# Altium schematic sheet TIDA-010954-Top.SchDoc
size 431 x 279 mm; Date: Not shown in title block; ApprovedBy: Not shown in title block; CheckedBy: Not shown in title block; Author: Not shown in title block; CompanyName: Not shown in title block; Engineer: Not shown in title block; Organization: Not shown in title block; Address1: Not shown in title block; Address2: Not shown in title block; Address3: Not shown in title block; Address4: Not shown in title block; DocumentNumber: 2; Revision: Use project parameter SCH_Rev; SheetNumber: 1; SheetTotal: 9; PageSetup: Record=PageOptions|CenterHorizontal=True|CenterVertical=True|PrintScale=1.00|XCorrection=1.00|YCorrection=1.00|PrintKind=0|BorderSize=5000000|LeftOffset=0|BottomOffset=0|Orientation=2|PaperLength=1000|PaperWidth=1000|Scale=100|PaperSource=15|PrintQuality=600|MediaType=1|DitherType=10|PaperKind=Letter|PrintScaleMode=1; CurrentTime: Not shown in title block; CurrentDate: Not shown in title block; Time: Not shown in title block; DocumentFullPathAndName: Not shown in title block; DocumentName: Not shown in title block; ModifiedDate: 1/25/2022; ImagePath: Not shown in title block
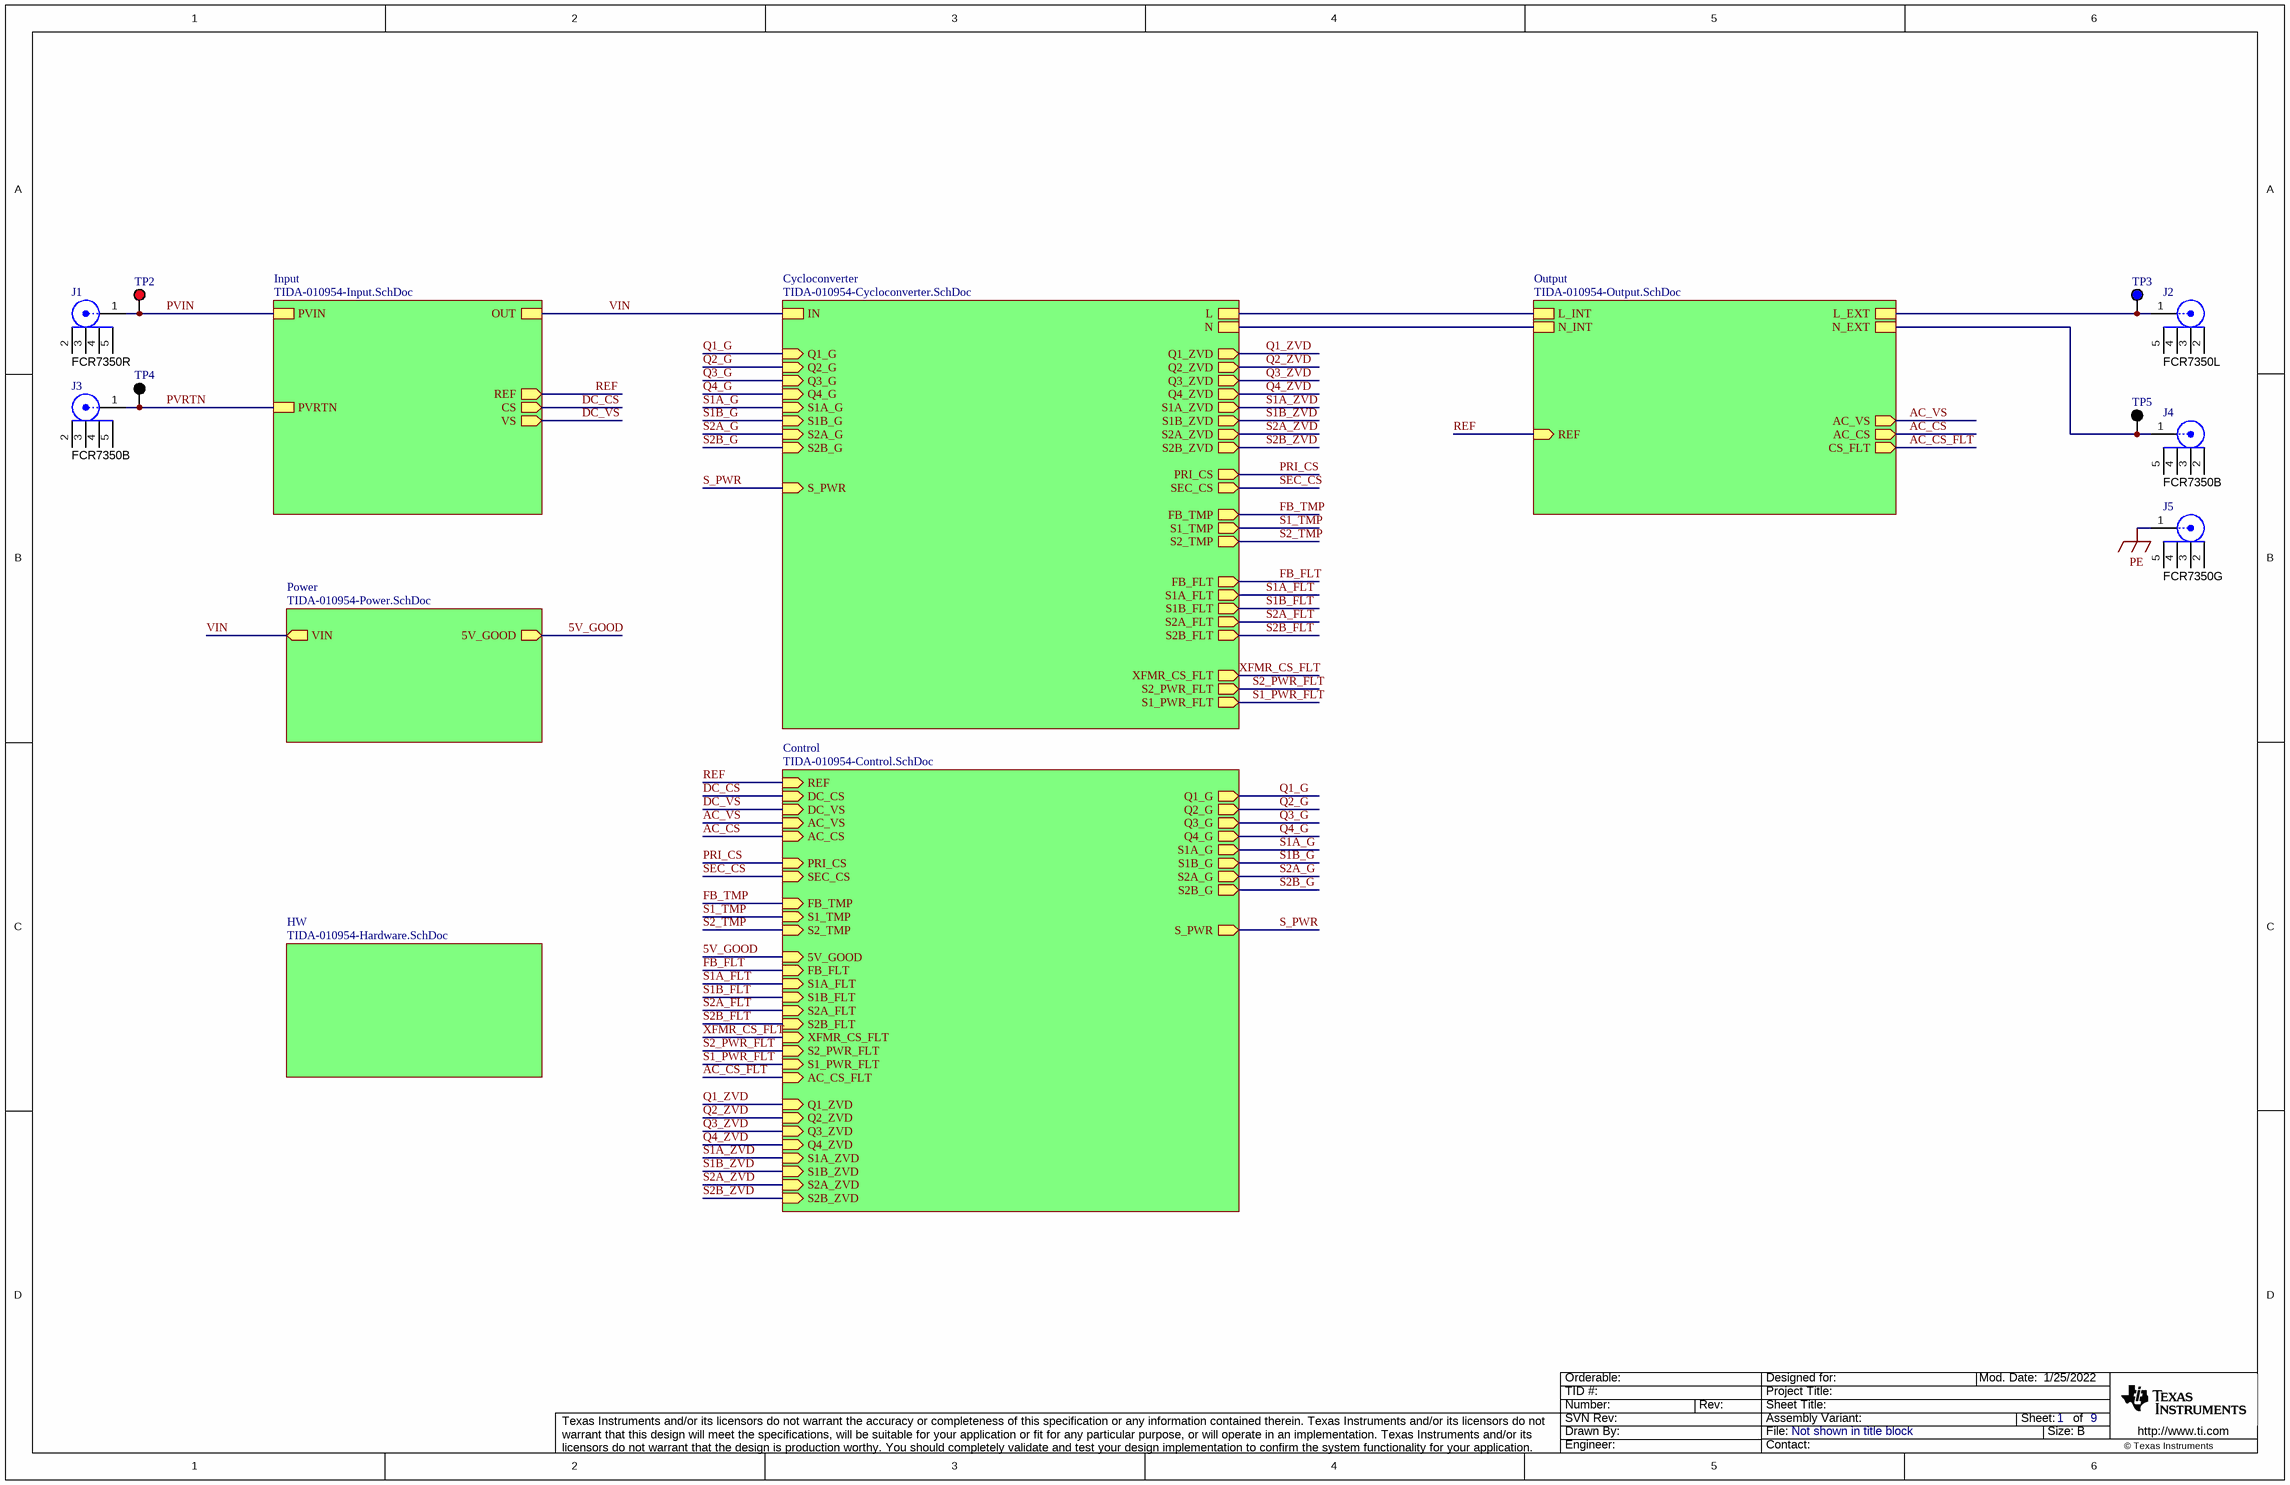
[diagram p0: TIDA-010954-Top.SchDoc]

## Parts
J1  FCR7350R  [Cliff_FCR7350R]
J2  FCR7350L  [FP-FCR7350L_CONN_BANANA_JACK-MFG]
J3  FCR7350B  [Cliff_FCR7350B]
J4  FCR7350B  [Cliff_FCR7350B]
J5  FCR7350G  [FP-FCR7350G_CONN_BANANA_JACK-MFG]
TP2  5010  [Keystone5010]  (value not drawn)
TP3  5127  [Keystone5127]  (value not drawn)
TP4  5011  [Keystone5011]  (value not drawn)
TP5  5011  [Keystone5011]  (value not drawn)

## Sub-sheets
Control = TIDA-010954-Control.SchDoc: Q1_G (out), Q2_G (out), Q3_G (out), Q4_G (out), S1A_G (out), S1B_G (out), S2A_G (out), S2B_G (out), S_PWR (out), 5V_GOOD (in), DC_CS (in), DC_VS (in), REF (in), AC_CS (in), AC_VS (in), PRI_CS (in), SEC_CS (in), FB_FLT (in), S1_PWR_FLT (in), XFMR_CS_FLT (in), S1A_FLT (in), S2_PWR_FLT (in), S2A_FLT (in), AC_CS_FLT (in), S1_TMP (in), S2_TMP (in), FB_TMP (in), Q2_ZVD (in), Q1_ZVD (in), Q4_ZVD (in), Q3_ZVD (in), S1A_ZVD (in), S1B_ZVD (in), S2A_ZVD (in), S2B_ZVD (in), S1B_FLT (in), S2B_FLT (in)
Cycloconverter = TIDA-010954-Cycloconverter.SchDoc: IN, N, L, Q1_G (in), Q2_G (in), Q3_G (in), Q4_G (in), S1A_G (in), S1B_G (in), S2A_G (in), S2B_G (in), S_PWR (in), PRI_CS (out), SEC_CS (out), FB_FLT (out), Q2_ZVD (out), Q1_ZVD (out), Q4_ZVD (out), Q3_ZVD (out), S1_PWR_FLT (out), XFMR_CS_FLT (out), S1A_ZVD (out), S1B_ZVD (out), S1A_FLT (out), S1_TMP (out), S2_PWR_FLT (out), S2A_ZVD (out), S2B_ZVD (out), S2A_FLT (out), S2_TMP (out), FB_TMP (out), S2B_FLT (out), S1B_FLT (out)
HW = TIDA-010954-Hardware.SchDoc: no entries
Input = TIDA-010954-Input.SchDoc: OUT, PVIN, PVRTN, CS (out), VS (out), REF (out)
Output = TIDA-010954-Output.SchDoc: L_INT, N_INT, L_EXT, N_EXT, CS_FLT (out), AC_CS (out), REF (in), AC_VS (out)
Power = TIDA-010954-Power.SchDoc: VIN (out), 5V_GOOD (out)

## Nets
PE: J5.1
5V_GOOD: sheet Power/5V_GOOD, sheet Control/5V_GOOD
AC_CS: sheet Output/AC_CS, sheet Control/AC_CS
AC_CS_FLT: sheet Output/CS_FLT, sheet Control/AC_CS_FLT
AC_VS: sheet Output/AC_VS, sheet Control/AC_VS
DC_CS: sheet Input/CS, sheet Control/DC_CS
DC_VS: sheet Input/VS, sheet Control/DC_VS
FB_FLT: sheet Cycloconverter/FB_FLT, sheet Control/FB_FLT
FB_TMP: sheet Cycloconverter/FB_TMP, sheet Control/FB_TMP
PRI_CS: sheet Cycloconverter/PRI_CS, sheet Control/PRI_CS
PVIN: J1.1 TP2.1 ; sheet Input/PVIN
PVRTN: J3.1 TP4.1 ; sheet Input/PVRTN
Q1_G: sheet Cycloconverter/Q1_G, sheet Control/Q1_G
Q1_ZVD: sheet Cycloconverter/Q1_ZVD, sheet Control/Q1_ZVD
Q2_G: sheet Cycloconverter/Q2_G, sheet Control/Q2_G
Q2_ZVD: sheet Cycloconverter/Q2_ZVD, sheet Control/Q2_ZVD
Q3_G: sheet Cycloconverter/Q3_G, sheet Control/Q3_G
Q3_ZVD: sheet Cycloconverter/Q3_ZVD, sheet Control/Q3_ZVD
Q4_G: sheet Cycloconverter/Q4_G, sheet Control/Q4_G
Q4_ZVD: sheet Cycloconverter/Q4_ZVD, sheet Control/Q4_ZVD
REF: sheet Input/REF, sheet Output/REF, sheet Control/REF
S1_PWR_FLT: sheet Cycloconverter/S1_PWR_FLT, sheet Control/S1_PWR_FLT
S1_TMP: sheet Cycloconverter/S1_TMP, sheet Control/S1_TMP
S1A_FLT: sheet Cycloconverter/S1A_FLT, sheet Control/S1A_FLT
S1A_G: sheet Cycloconverter/S1A_G, sheet Control/S1A_G
S1A_ZVD: sheet Cycloconverter/S1A_ZVD, sheet Control/S1A_ZVD
S1B_FLT: sheet Cycloconverter/S1B_FLT, sheet Control/S1B_FLT
S1B_G: sheet Cycloconverter/S1B_G, sheet Control/S1B_G
S1B_ZVD: sheet Cycloconverter/S1B_ZVD, sheet Control/S1B_ZVD
S2_PWR_FLT: sheet Cycloconverter/S2_PWR_FLT, sheet Control/S2_PWR_FLT
S2_TMP: sheet Cycloconverter/S2_TMP, sheet Control/S2_TMP
S2A_FLT: sheet Cycloconverter/S2A_FLT, sheet Control/S2A_FLT
S2A_G: sheet Cycloconverter/S2A_G, sheet Control/S2A_G
S2A_ZVD: sheet Cycloconverter/S2A_ZVD, sheet Control/S2A_ZVD
S2B_FLT: sheet Cycloconverter/S2B_FLT, sheet Control/S2B_FLT
S2B_G: sheet Cycloconverter/S2B_G, sheet Control/S2B_G
S2B_ZVD: sheet Cycloconverter/S2B_ZVD, sheet Control/S2B_ZVD
S_PWR: sheet Cycloconverter/S_PWR, sheet Control/S_PWR
SEC_CS: sheet Cycloconverter/SEC_CS, sheet Control/SEC_CS
VIN: sheet Power/VIN, sheet Input/OUT, sheet Cycloconverter/IN
XFMR_CS_FLT: sheet Cycloconverter/XFMR_CS_FLT, sheet Control/XFMR_CS_FLT
NetJ2_1: J2.1 TP3.1 ; sheet Output/L_EXT
NetJ4_1: J4.1 TP5.1 ; sheet Output/N_EXT
(unnamed): sheet Output/L_INT, sheet Cycloconverter/L
(unnamed): sheet Output/N_INT, sheet Cycloconverter/N

Not connected (* = marked no-connect by the designer): J1 2 3 4 5; J2 2 3 4 5; J3 2 3 4 5; J4 2 3 4 5; J5 2 3 4 5

## Notes on the sheet
- Drawn By:
- SVN Rev:
- Number:
- TID #:
- Orderable:
- Rev:
- Sheet Title:
- File:
- Project Title:
- Designed for:
- Assembly Variant:
- Mod. Date:
- Sheet:
- Size:
- of
- B
- http://www.ti.com
- Texas Instruments and/or its licensors do not warrant the accuracy or completeness of this specification or any information contained therein. Texas Instruments and/or its licensors do not warrant that this design will meet the specifications, will be suitable for your application or fit for any particular purpose, or will operate in an implementation. Texas Instruments and/or its licensors do not warrant that the design is production worthy. You should completely validate and test your design implementation to confirm the system functionality for your application.
- Engineer:
- Contact:
- © Texas Instruments

## Library data of the parts
J1 = CMP-0055799-1: Panel Socket, 24A, R/A, Gold, TH; Manufacturer: Cliff Electronic Components; CNHeader: FALSE; Gender: Female; Voltage_V: 1kV; ComponentLink1URL: http://www.cliffuk.co.uk/products/testleads/sockets/S16NPC.pdf; Supplier Part Number 2: 1854508; Publisher: Texas Instruments; Supplier 2: Farnell; Color: Red; RoHS: Y; MountType: TH; Supplier 1: Newark; PackageReference: Panel Socket, R/A, TH; PinCount: 5; CompType: Socket; LatestRevisionDate: 26/05/2017; PartNumber: FCR7350R; Orientation: R/A; ComponentLink1Description: Datasheet URL; Supplier Part Number 1: 20T2058; ContactFinish: Gold; CT: FALSE; Current_A: 24A
J2 = CMP-0098295-2: Banana Test Connector, 4mm, Socket, PCB Mount, 24 A, 1 kV, Gold Plated Contacts, Blue; Manufacturer: CLIFF Electronic Components; Current_A: 24A; Voltage_V: 1kV; AEC Qualified: No; Conn Orientation: Right Angle; SizeZ_mm: 11.6mm; Standoff Height: 0.7mm; ContactFinish: Gold; PackageReference: CONN_BANANA_JACK; PartNumber: FCR7350L; PinCount: 1; RoHS: TRUE; Part Number: FCR7350L; datasheet: https://www.cliffuk.co.uk/products/testleads/sockets/fcr7350.pdf; Datasheet Path: datasheets/Conn-FCR7350L.pdf; helpURL: https://upverter.com/upn/revision/8f9f2a5472dd5be9/; Lead Free: Yes; Operating Temperature Range: -40°C to +80°C; ComponentLink1Description: Datasheet; ComponentLink1URL: https://www.cliffuk.co.uk/products/testleads/sockets/fcr7350.pdf
J3 J4 = CMP-0055798-1: Panel Socket, 24A, R/A, Gold, TH; Manufacturer: Cliff Electronic Components; CNHeader: FALSE; Gender: Female; Voltage_V: 1kV; ComponentLink1URL: http://www.cliffuk.co.uk/products/testleads/sockets/S16NPC.pdf; Supplier Part Number 2: 1854507; Publisher: Texas Instruments; Supplier 2: Farnell; Current_A: 24A; Color: Black; RoHS: Y; MountType: TH; Supplier 1: Newark; PackageReference: Panel Socket, R/A, TH; PinCount: 5; CompType: Socket; LatestRevisionDate: 26/05/2017; PartNumber: FCR7350B; Orientation: R/A; ComponentLink1Description: Datasheet URL; Supplier Part Number 1: 20T2055; ContactFinish: Gold; CT: FALSE
J5 = CMP-0098294-2: Banana Test Connector, Socket, PCB Mount, 24 A, 1 kV, Gold Plated Contacts, Green; Manufacturer: CLIFF Electronic Components; Current_A: 24A; Voltage_V: 1kV; AEC Qualified: No; Conn Orientation: Right Angle; SizeZ_mm: 11.6mm; Standoff Height: 0.7mm; ContactFinish: Gold; PackageReference: CONN_BANANA_JACK; PartNumber: FCR7350G; PinCount: 1; RoHS: TRUE; Supplier 1: Digikey; Supplier Part Number 1: 4654-FCR7350G-ND; Part Number: FCR7350G; datasheet: https://www.cliffuk.co.uk/products/testleads/sockets/fcr7350.pdf; Datasheet Path: datasheets/Conn-FCR7350G.pdf; Digikey Description: 4MM PANEL SKT S16N-PC GREEN; Digikey Part Number: 4654-FCR7350G-ND; helpURL: https://upverter.com/upn/revision/a67ebcb8ee144784/; Lead Free: Yes; Operating Temperature Range: -40°C to +80°C; ComponentLink1Description: Datasheet; ComponentLink1URL: https://www.cliffuk.co.uk/products/testleads/sockets/fcr7350.pdf
TP2 = CMP-0055147-2: Test Point, Multipurpose, Red, TH; Manufacturer: Keystone Electronics; CT: TRUE; ContactFinish: Silver; Green_Lifecycle: Active; CNHeader: FALSE; Green_REACh: Passed; PackageReference: Red Multipurpose Testpoint; MountType: TH; Supplier Part Number 1: 36-5010-ND; PartNumber: 5010; ComponentLink1URL: http://www.keyelco.com/userAssets/file/M60-2p60.pdf; Publisher: Texas Instruments; LatestRevisionDate: 26/05/2017; ComponentLink1Description: Datasheet URL; RoHS: Y; Supplier Part Number 2: 534-5010; Green_EU RoHS-2: Incomplete; CompType: Test Point; Supplier 2: Mouser; Supplier 1: Digi-Key; Green_EU RoHS: Passed; Color: Red
TP3 = CMP-0055156-2: Test Point, Multipurpose, Blue, TH; Manufacturer: Keystone Electronics; CT: TRUE; ContactFinish: Silver; CNHeader: FALSE; Green_REACh: Passed; Green_Lifecycle: Active; CompType: Test Point; LatestRevisionDate: 26/05/2017; Supplier Part Number 3: 534-5127; Color: Blue; MountType: TH; Publisher: Texas Instruments; ComponentLink1URL: http://www.keyelco.com/userAssets/file/M60-2p60.pdf; RoHS: Y; ComponentLink1Description: Datasheet URL; PackageReference: Blue Multipurpose Testpoint; Green_EU RoHS-2: Incomplete; Supplier 2: Newark; Supplier Part Number 2: 95M2499; PartNumber: 5127; Supplier 3: Mouser; Supplier Part Number 1: 36-5127-ND; Supplier 1: Digi-Key; Green_EU RoHS: Passed
TP4 TP5 = CMP-0055148-2: Test Point, Multipurpose, Black, TH; Manufacturer: Keystone Electronics; CNHeader: FALSE; ContactFinish: Silver; Green_REACh: Passed; Green_Lifecycle: Active; CT: TRUE; ComponentLink1Description: Datasheet URL; Supplier 1: Digi-Key; MountType: TH; Supplier 2: Mouser; LatestRevisionDate: 26/05/2017; Publisher: Texas Instruments; PartNumber: 5011; Color: Black; ComponentLink1URL: http://www.keyelco.com/userAssets/file/M60-2p60.pdf; Green_EU RoHS-2: Incomplete; Supplier Part Number 1: 36-5011-ND; Supplier Part Number 2: 534-5011; Green_EU RoHS: Passed; RoHS: Y; PackageReference: Black Multipurpose Testpoint; CompType: Test Point